# Altium project ReceptorCB.PrjPCB
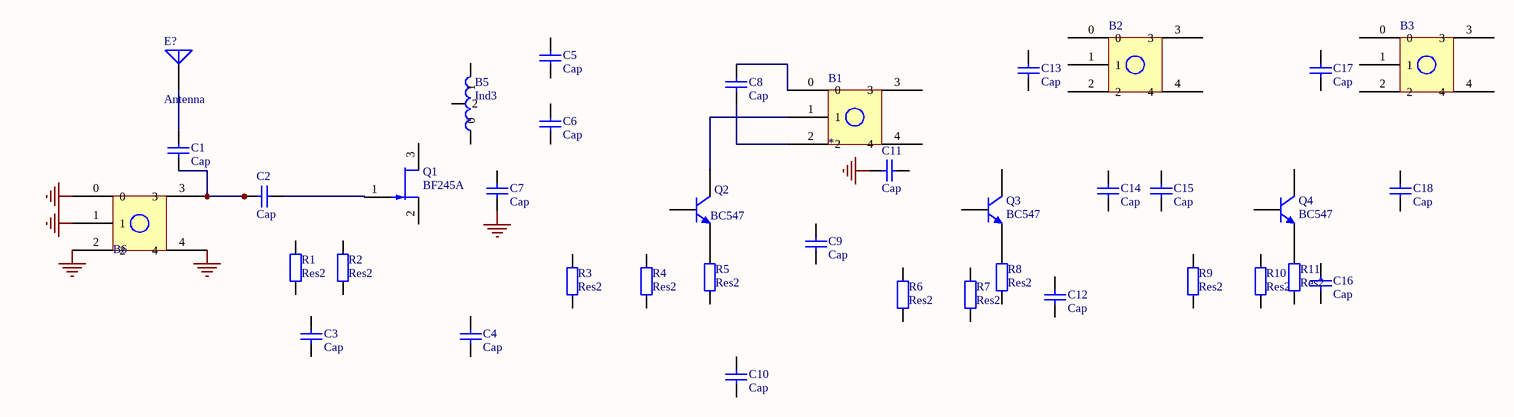
[diagram p0: ReceptorCB.SchDoc]
1 sheet, 39 parts. Net scope: global (net labels, ports and power ports of the same name join across sheets).

## Sheet ReceptorCB.SchDoc
size A4

### Parts
B1  *  [formita05]
B2  *  [formita05]  (value not drawn)
B3  *  [formita05]  (value not drawn)
B5  Ind3  [Ind 7mm]
B6  Formita05  [formita05]  (value not drawn)
C1  Cap  [RAD-0.3]
C2  Cap  [RAD-0.3]
C3  Cap  [RAD-0.3]
C4  Cap  [RAD-0.3]
C5  Cap  [CAPR5.08-7.8x3.2]
C6  Cap  [CAPR5.08-7.8x3.2]
C7  Cap  [RAD-0.3]
C8  Cap  [CAPR5.08-7.8x3.2]
C9  Cap  [RAD-0.3]
C10  Cap  [RAD-0.3]
C11  Cap  [RAD-0.3]
C12  Cap  [RAD-0.3]
C13  Cap  [CAPR5.08-7.8x3.2]
C14  Cap  [RAD-0.3]
C15  Cap  [RAD-0.3]
C16  Cap  [RAD-0.3]
C17  Cap  [CAPR5.08-7.8x3.2]
C18  Cap  [RAD-0.3]
E?  Antenna  [PIN1]
Q1  BF245A  [29-04]
Q2  BC547  [BCY-W3]
Q3  BC547  [BCY-W3]
Q4  BC547  [BCY-W3]
R1  Res2  [AXIAL-0.4]
R2  Res2  [AXIAL-0.4]
R3  Res2  [AXIAL-0.4]
R4  Res2  [AXIAL-0.4]
R5  Res2  [AXIAL-0.4]
R6  Res2  [AXIAL-0.4]
R7  Res2  [AXIAL-0.4]
R8  Res2  [AXIAL-0.4]
R9  Res2  [AXIAL-0.4]
R10  Res2  [AXIAL-0.4]
R11  Res2  [AXIAL-0.4]

### Nets
GND: B6.0 B6.1 B6.2 B6.4 C7.2 C11.1
NetB1_0: B1.0 C8.2
NetB1_1: B1.1 Q2.3(C)
NetB1_2: B1.2 C8.1
NetB6_3: B6.3 C1.1 C2.2
NetC1_2: C1.2 E?.1(A)
NetC2_1: C2.1 Q1.1(G)
NetQ2_1: Q2.1(E) R5.2
NetQ3_1: Q3.1(E) R8.2
NetQ4_1: Q4.1(E) R11.2

Not connected (* = marked no-connect by the designer): B1 3 4; B2 0 1 2 3 4; B3 0 1 2 3 4; B5 0 1 2; C3 1 2; C4 1 2; C5 1 2; C6 1 2; C7 1; C9 1 2; C10 1 2; C11 2; C12 1 2; C13 1 2; C14 1 2; C15 1 2; C16 1 2; C17 1 2; C18 1 2; Q1 2(S) 3(D); Q2 2(B); Q3 2(B) 3(C); Q4 2(B) 3(C); R1 1 2; R2 1 2; R3 1 2; R4 1 2; R5 1; R6 1 2; R7 1 2; R8 1; R9 1 2; R10 1 2; R11 1

### Library data of the parts
B1-B3 B6 = Formita05: Forma bobina d=0.5cm
C1-C18 = Cap: Capacitor; Published: 8-Jun-2000; LatestRevisionDate: 17-Jul-2002; LatestRevisionNote: Re-released for DXP Platform.; Publisher: Altium Limited
E? = Antenna: Generic Antenna; Published: 24-Mar-1999; LatestRevisionDate: 17-Jul-2002; LatestRevisionNote: Re-released for DXP Platform.; Publisher: Altium Limited
Q1 = BF245A: JFET VHF / UHF Amplifier; PackageDocument: 1996; Published: 29-Sep-2000; LatestRevisionDate: 17-Jul-2002; LatestRevisionNote: Re-released for DXP Platform.; DatasheetDocument: 1991; PackageReference: 29-04; Publisher: Altium Limited; ComponentLink1Description: Manufacturer Link; ComponentLink1URL: http://www.motorola.com/
R1-R11 = Res2: Resistor; Published: 8-Jun-2000; LatestRevisionDate: 17-Jul-2002; LatestRevisionNote: Re-released for DXP Platform.; Publisher: Altium Limited